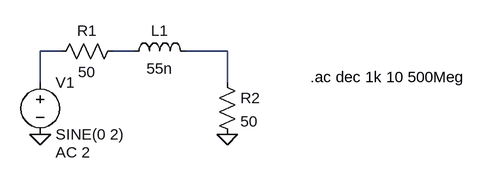
[diagram p0: schematic Lstrays.asc]
Lstrays.asc, the LTspice schematic file:
Version 4
SHEET 1 880 680
WIRE 32 80 0 80
WIRE 144 80 112 80
WIRE 288 80 224 80
WIRE 0 128 0 80
WIRE 288 128 288 80
FLAG 0 208 0
FLAG 288 208 0
SYMBOL voltage 0 112 R0
WINDOW 123 24 124 Left 2
WINDOW 39 0 0 Left 0
SYMATTR InstName V1
SYMATTR Value SINE(0 2)
SYMATTR Value2 AC 2
SYMBOL ind 128 96 R270
WINDOW 0 32 56 VTop 2
WINDOW 3 5 56 VBottom 2
SYMATTR InstName L1
SYMATTR Value 55n
SYMBOL res 128 64 R90
WINDOW 0 0 56 VBottom 2
WINDOW 3 32 56 VTop 2
SYMATTR InstName R1
SYMATTR Value 50
SYMBOL res 272 112 R0
SYMATTR InstName R2
SYMATTR Value 50
TEXT 416 120 Left 2 !.ac dec 1k 10 500Meg

The netlist it stands for:
* Lstrays.asc
V1 N001 0 SINE(0 2) AC 2
L1 N002 N003 55n
R1 N002 N001 50
R2 N003 0 50
.ac dec 1k 10 500Meg
.backanno
.end